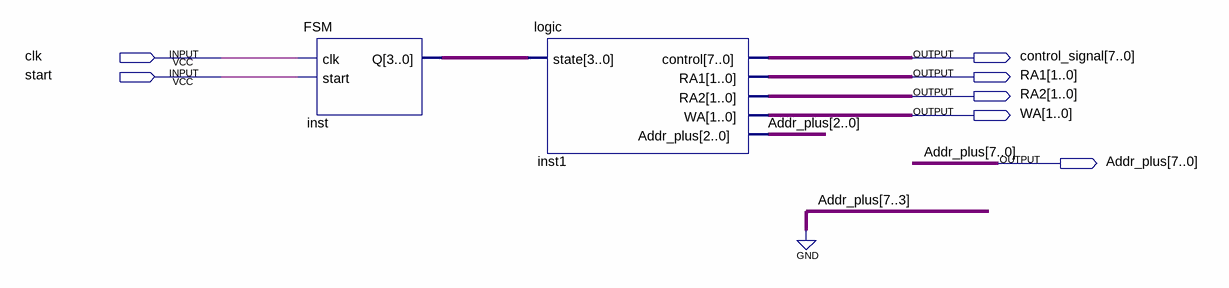
[diagram p0: schematic sheet]
// Quartus schematic Controller.bdf as structural Verilog: 2 symbols, 7 pins
module Controller (
  input  clk,
  input  start,
  output [7:0] control_signal,
  output [1:0] RA1,
  output [1:0] RA2,
  output [1:0] WA,
  output [7:0] Addr_plus
);

  wire [3:0] inst_q;

  FSM inst (.clk(clk), .start(start), .Q(inst_q));
  \logic  inst1 (.state(inst_q), .control(control_signal), .RA1(RA1), .RA2(RA2), .WA(WA), .Addr_plus(Addr_plus[2:0]));

  assign Addr_plus[7:3] = {5{1'b0}};
endmodule
